# Altium schematic sheet Indicateurs DEL.SchDoc: Indicateurs DEL
size Letter; Author: AC/KC; Engineer: k.cotton; Organization: Cegep Limoilou; Address1: 1300, 8e Avenue; Address2: Québec, QC; Address3: Canada; Address4: G1J 5L5; SheetNumber: 1; SheetTotal: 1
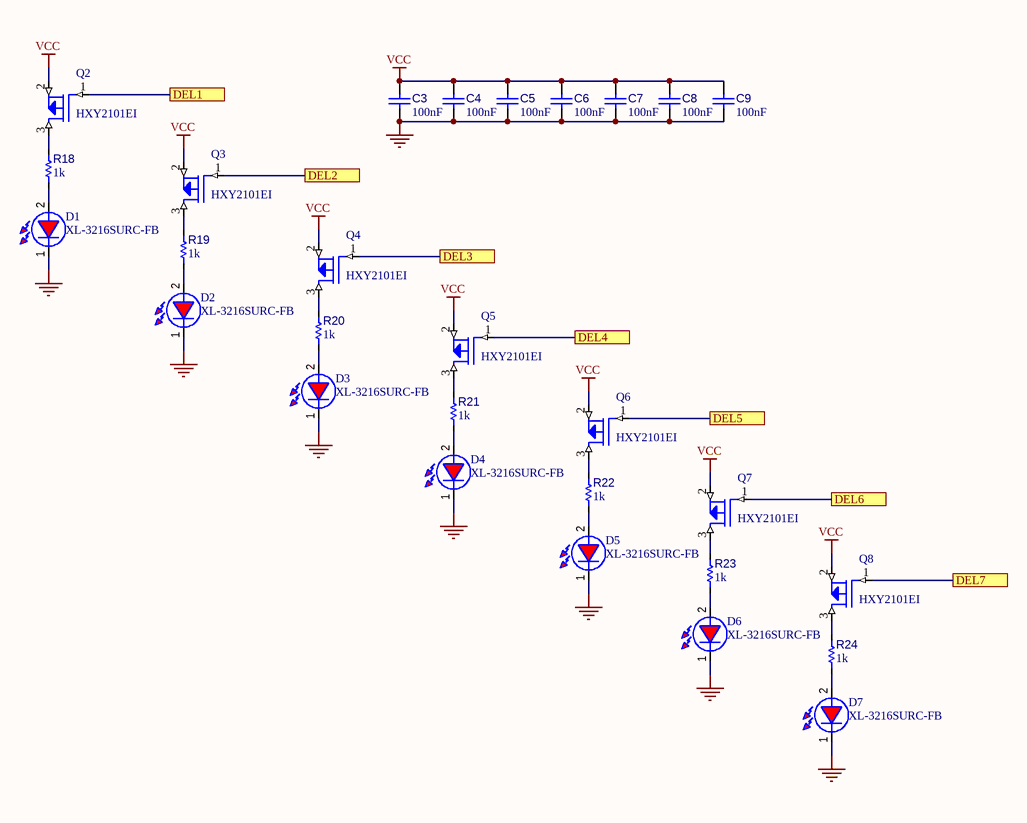
[diagram p0: Indicateurs DEL.SchDoc]

## Parts
C3  value 100nF  [C_1608[0603]]  (hidden comment: CAP CER 100nF 50V 0603)
C4  value 100nF  [C_1608[0603]]  (hidden comment: CAP CER 100nF 50V 0603)
C5  value 100nF  [C_1608[0603]]  (hidden comment: CAP CER 100nF 50V 0603)
C6  value 100nF  [C_1608[0603]]  (hidden comment: CAP CER 100nF 50V 0603)
C7  value 100nF  [C_1608[0603]]  (hidden comment: CAP CER 100nF 50V 0603)
C8  value 100nF  [C_1608[0603]]  (hidden comment: CAP CER 100nF 50V 0603)
C9  value 100nF  [C_1608[0603]]  (hidden comment: CAP CER 100nF 50V 0603)
D1  XL-3216SURC-FB  [LED 1206]
D2  XL-3216SURC-FB  [LED 1206]
D3  XL-3216SURC-FB  [LED 1206]
D4  XL-3216SURC-FB  [LED 1206]
D5  XL-3216SURC-FB  [LED 1206]
D6  XL-3216SURC-FB  [LED 1206]
D7  XL-3216SURC-FB  [LED 1206]
Q2  HXY2101EI  [SOT-323]
Q3  HXY2101EI  [SOT-323]
Q4  HXY2101EI  [SOT-323]
Q5  HXY2101EI  [SOT-323]
Q6  HXY2101EI  [SOT-323]
Q7  HXY2101EI  [SOT-323]
Q8  HXY2101EI  [SOT-323]
R18  value 1k  [R_1608[0603]]  (hidden comment: Res 1k 1% 0603)
R19  value 1k  [R_1608[0603]]  (hidden comment: Res 1k 1% 0603)
R20  value 1k  [R_1608[0603]]  (hidden comment: Res 1k 1% 0603)
R21  value 1k  [R_1608[0603]]  (hidden comment: Res 1k 1% 0603)
R22  value 1k  [R_1608[0603]]  (hidden comment: Res 1k 1% 0603)
R23  value 1k  [R_1608[0603]]  (hidden comment: Res 1k 1% 0603)
R24  value 1k  [R_1608[0603]]  (hidden comment: Res 1k 1% 0603)

## Ports
DEL1, DEL2, DEL3, DEL4, DEL5, DEL6, DEL7

## Nets
GND: C3.1 C4.1 C5.1 C6.1 C7.1 C8.1 C9.1 D1.1(K) D2.1(K) D3.1(K) D4.1(K) D5.1(K) D6.1(K) D7.1(K)
VCC: C3.2 C4.2 C5.2 C6.2 C7.2 C8.2 C9.2 Q2.2(SOURCE) Q3.2(SOURCE) Q4.2(SOURCE) Q5.2(SOURCE) Q6.2(SOURCE) Q7.2(SOURCE) Q8.2(SOURCE)
DEL1: Q2.1(GATE) ; port DEL1
DEL2: Q3.1(GATE) ; port DEL2
DEL3: Q4.1(GATE) ; port DEL3
DEL4: Q5.1(GATE) ; port DEL4
DEL5: Q6.1(GATE) ; port DEL5
DEL6: Q7.1(GATE) ; port DEL6
DEL7: Q8.1(GATE) ; port DEL7
NetD1_2: D1.2(A) R18.1
NetD2_2: D2.2(A) R19.1
NetD3_2: D3.2(A) R20.1
NetD4_2: D4.2(A) R21.1
NetD5_2: D5.2(A) R22.1
NetD6_2: D6.2(A) R23.1
NetD7_2: D7.2(A) R24.1
NetQ2_3: Q2.3(DRAIN) R18.2
NetQ3_3: Q3.3(DRAIN) R19.2
NetQ4_3: Q4.3(DRAIN) R20.2
NetQ5_3: Q5.3(DRAIN) R21.2
NetQ6_3: Q6.3(DRAIN) R22.2
NetQ7_3: Q7.3(DRAIN) R23.2
NetQ8_3: Q8.3(DRAIN) R24.2

## Notes on the sheet
- Titre :
- Conception :
- Date :
- Approbation :
- Heure :
- Révision :
- Feuille
- de
- Fichier :

## Library data of the parts
C3-C9 = CAP002: Capacitor type 1; Manufacturer 1: Yageo; Manufacturer Part Number 1: CC0603KRX7R9BB104; LibRef: CAP002; Code CEGEP: COND0143SM; Tolerance: 10%; Dielectric: X7R; Rated Voltage: 50V; Mounting Technology: SMT; Supplier 1: LCSC; Supplier Part Number 1: C14663
D1-D7 = D_LED_RED_1206: DEL Rouge 1206; Manufacturer 1: XINGLIGHT; Code CEGEP: LEDROUGECLAIR; Localisation: AVP-14; Manufacturer Part Number 1: XL-3216SURC-FB; Supplier 1: LCSC; Supplier Part Number 1: C3646938; Manufacturer 2: Würth Elektronik; Manufacturer Part Number 2: 150120RS75000; Supplier 2: Digikey; Supplier Part Number 2: 732-4991-1-ND; Mounting Technology: SMT
Q2-Q8 = Q_PMOS-20V-1.8A: MOSFET P-CH 20V 1.8A SOT-323; Manufacturer 1: HXY Mosfet; Manufacturer Part Number 1: HXY2101EI; Supplier 1: LCSC; Supplier Part Number 1: C5148643; Manufacturer 2: MCC; Manufacturer Part Number 2: SI2101A-TP; Supplier 2: Digikey; Supplier Part Number 2: 353-SI2101A-TPCT-ND; Mounting Technology: SMT
R18-R24 = RES015: Resistor type 1; Manufacturer 1: Yageo; Manufacturer Part Number 1: RC0603FR-071KL; LibRef: RES015; Puissance: 1/10W; Max Working Voltage: 75V; Tolerance: 1%; Mounting Technology: SMT; Supplier 1: LCSC; Supplier Part Number 1: C22548